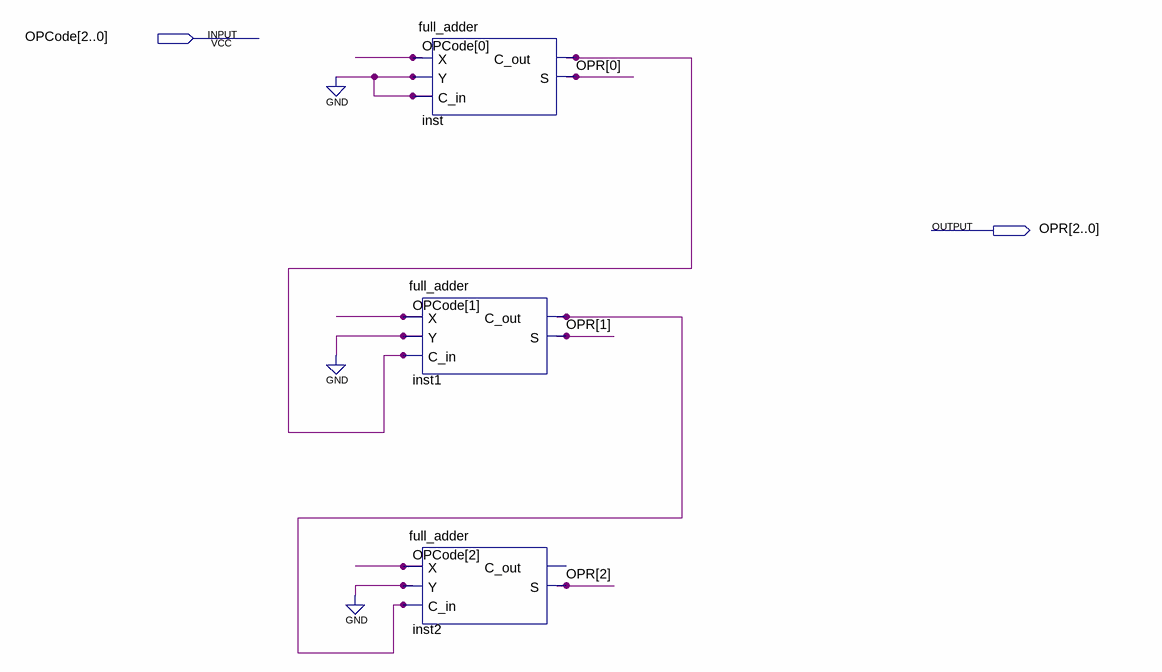
[diagram p0: schematic sheet]
// Quartus schematic opcode.bdf as structural Verilog: 3 symbols, 2 pins
module opcode (
  input  [2:0] OPCode,
  output [2:0] OPR
);

  wire inst1_c_out, inst_c_out;

  full_adder inst (.X(OPCode[0]), .Y(1'b0), .C_in(1'b0), .C_out(inst_c_out), .S(OPR[0]));
  full_adder inst1 (.X(OPCode[1]), .Y(1'b0), .C_in(inst_c_out), .C_out(inst1_c_out), .S(OPR[1]));
  full_adder inst2 (.X(OPCode[2]), .Y(1'b0), .C_in(inst1_c_out), .S(OPR[2]));  // open: C_out
endmodule
